# Altium schematic sheet Sheet1.SchDoc
size A4; Organization: Altium Limited; Address1: L3, 12a Rodborough Rd; Address2: Frenchs Forest; Address3: NSW; Address4: Australia 2086
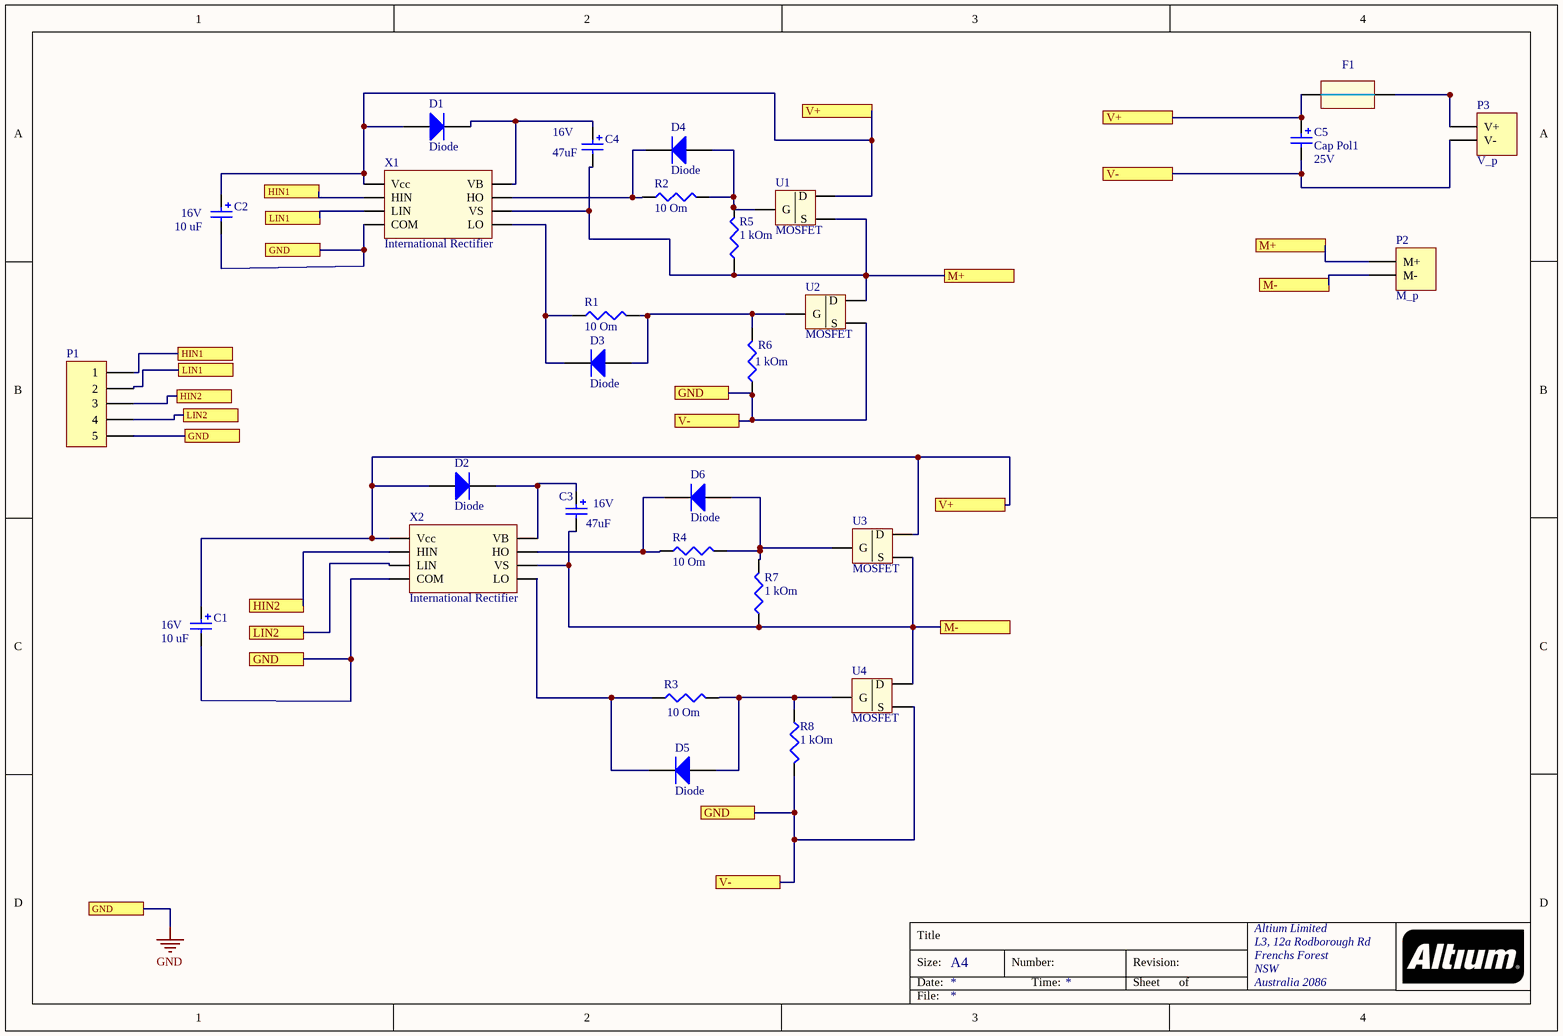
[diagram p0: Sheet1.SchDoc]

## Parts
C1  16V  value 10 uF  [smd cap]
C2  16V  value 10 uF  [smd cap]
C3  16V  value 47uF  [smd cap]
C4  16V  value 47uF  [smd cap]
C5  Cap Pol1  value 25V  [Cap El]
D1  Diode  [SOD123]
D2  Diode  [SOD123]
D3  Diode  [SOD123]
D4  Diode  [SOD123]
D5  Diode  [SOD123]
D6  Diode  [SOD123]
F1  Fuse  [FH-101]  (value not drawn)
P1  jst5  [JST5]  (value not drawn)
P2  M_p  [M_pin]
P3  V_p  [V_pin]
R1  10 Om  [14-1210]
R2  10 Om  [14-1210]
R3  value 10 Om  [14-1210]  (hidden comment: Res3)
R4  10 Om  [14-1210]
R5  1 kOm  [14-1210]
R6  value 1 kOm  [14-1210]  (hidden comment: Res3)
R7  1 kOm  [14-1210]
R8  1 kOm  [14-1210]
U1  MOSFET  [SMD220_10CTQ150]
U2  MOSFET  [SMD220_10CTQ150]
U3  MOSFET  [SMD220_10CTQ150]
U4  MOSFET  [SMD220_10CTQ150]
X1  International Rectifier  [SOIC8]
X2  International Rectifier  [SOIC8]

## Ports
GND, HIN1, HIN2, LIN1, LIN2, M+, M-, V+, V-

## Nets
GND: C1.2 C2.2 C5.2 P1.5 P3.2(V-) R6.1 R8.2 U2.3(S) U4.3(S) X1.4(COM) X2.4(COM) ; port GND, port V-
HIN1: P1.1 X1.2(HIN) ; port HIN1
HIN2: P1.3 X2.2(HIN) ; port HIN2
LIN1: P1.2 X1.3(LIN) ; port LIN1
LIN2: P1.4 X2.3(LIN) ; port LIN2
M+: C4.2 P2.1(M+) R5.1 U1.3(S) U2.2(D) X1.6(VS) ; port M+
M-: C3.2 P2.2(M-) R7.1 U3.3(S) U4.2(D) X2.6(VS) ; port M-
V+: C1.1 C2.1 C5.1 D1.1(A) D2.1(A) F1.1 U1.2(D) U3.2(D) X1.1(Vcc) X2.1(Vcc) ; port V+
NetC3_1: C3.1 D2.2(K) X2.8(VB)
NetC4_1: C4.1 D1.2(K) X1.8(VB)
NetD3_1: D3.1(A) R1.2 R6.2 U2.1(G)
NetD3_2: D3.2(K) R1.1 X1.5(LO)
NetD4_1: D4.1(A) R2.2 R5.2 U1.1(G)
NetD4_2: D4.2(K) R2.1 X1.7(HO)
NetD5_1: D5.1(A) R3.2 R8.1 U4.1(G)
NetD5_2: D5.2(K) R3.1 X2.5(LO)
NetD6_1: D6.1(A) R4.2 R7.2 U3.1(G)
NetD6_2: D6.2(K) R4.1 X2.7(HO)
NetF1_2: F1.2 P3.1(V+)

## Notes on the sheet
- Title
- Size:
- Date:
- A4
- Number:
- Time:
- Revision:
- Sheet
- of
- File:

## Library data of the parts
C1-C5 = Cap smd: Polarized Capacitor (Radial); Published: 8-Jun-2000; LatestRevisionDate: 17-Jul-2002; LatestRevisionNote: Re-released for DXP Platform.; PackageReference: RB7.6-15; Publisher: Altium Limited; PackageDescription: Polarized Capacitor (Radial); 2 Leads
D1-D6 = Diode: Default Diode; Published: 8-Jun-2000; LatestRevisionDate: 17-Jul-2002; LatestRevisionNote: Re-released for DXP Platform.; PackageVersion: Sep-1996; PackageReference: SMC; Publisher: Altium Limited; PackageDescription: DO-214-AB/SMC; 2 C-Bend Leads; Body 7.9 x 5.9 mm, inc. leads (LxW); Code_JEDEC: DO-214-AB
F1 = FH-101
P1 = jst5: Header, 5-Pin; LatestRevisionDate: 17-Jul-2002; LatestRevisionNote: Re-released for DXP Platform.; Publisher: Altium Limited
R1 R4 R5 R7 R8 = Res3: Resistor; Value: 1K; Published: 8-Jun-2000; LatestRevisionDate: 29-May-2009; LatestRevisionNote: IPC-7351 Footprint Added.; PackageReference: J1-0603; Publisher: Altium Limited; PackageDescription: Chip Resistor
R2 R3 R6 = Res3: Resistor; Published: 8-Jun-2000; LatestRevisionDate: 29-May-2009; LatestRevisionNote: IPC-7351 Footprint Added.; PackageReference: J1-0603; Publisher: Altium Limited; PackageDescription: Chip Resistor
U1-U4 = IRFZ14PBF: Configuration: Single; Vds: 60V; Qg: 11nC; Qgs: 3.1nC; Qgd: 5.8nC
X1 X2 = IR2101SPBF